# EAGLE schematic SBC_65C02_IRQ_BigBoard_v9-1-3 (EAGLE 9.6.2)

## Sheet 1 of 7: Power
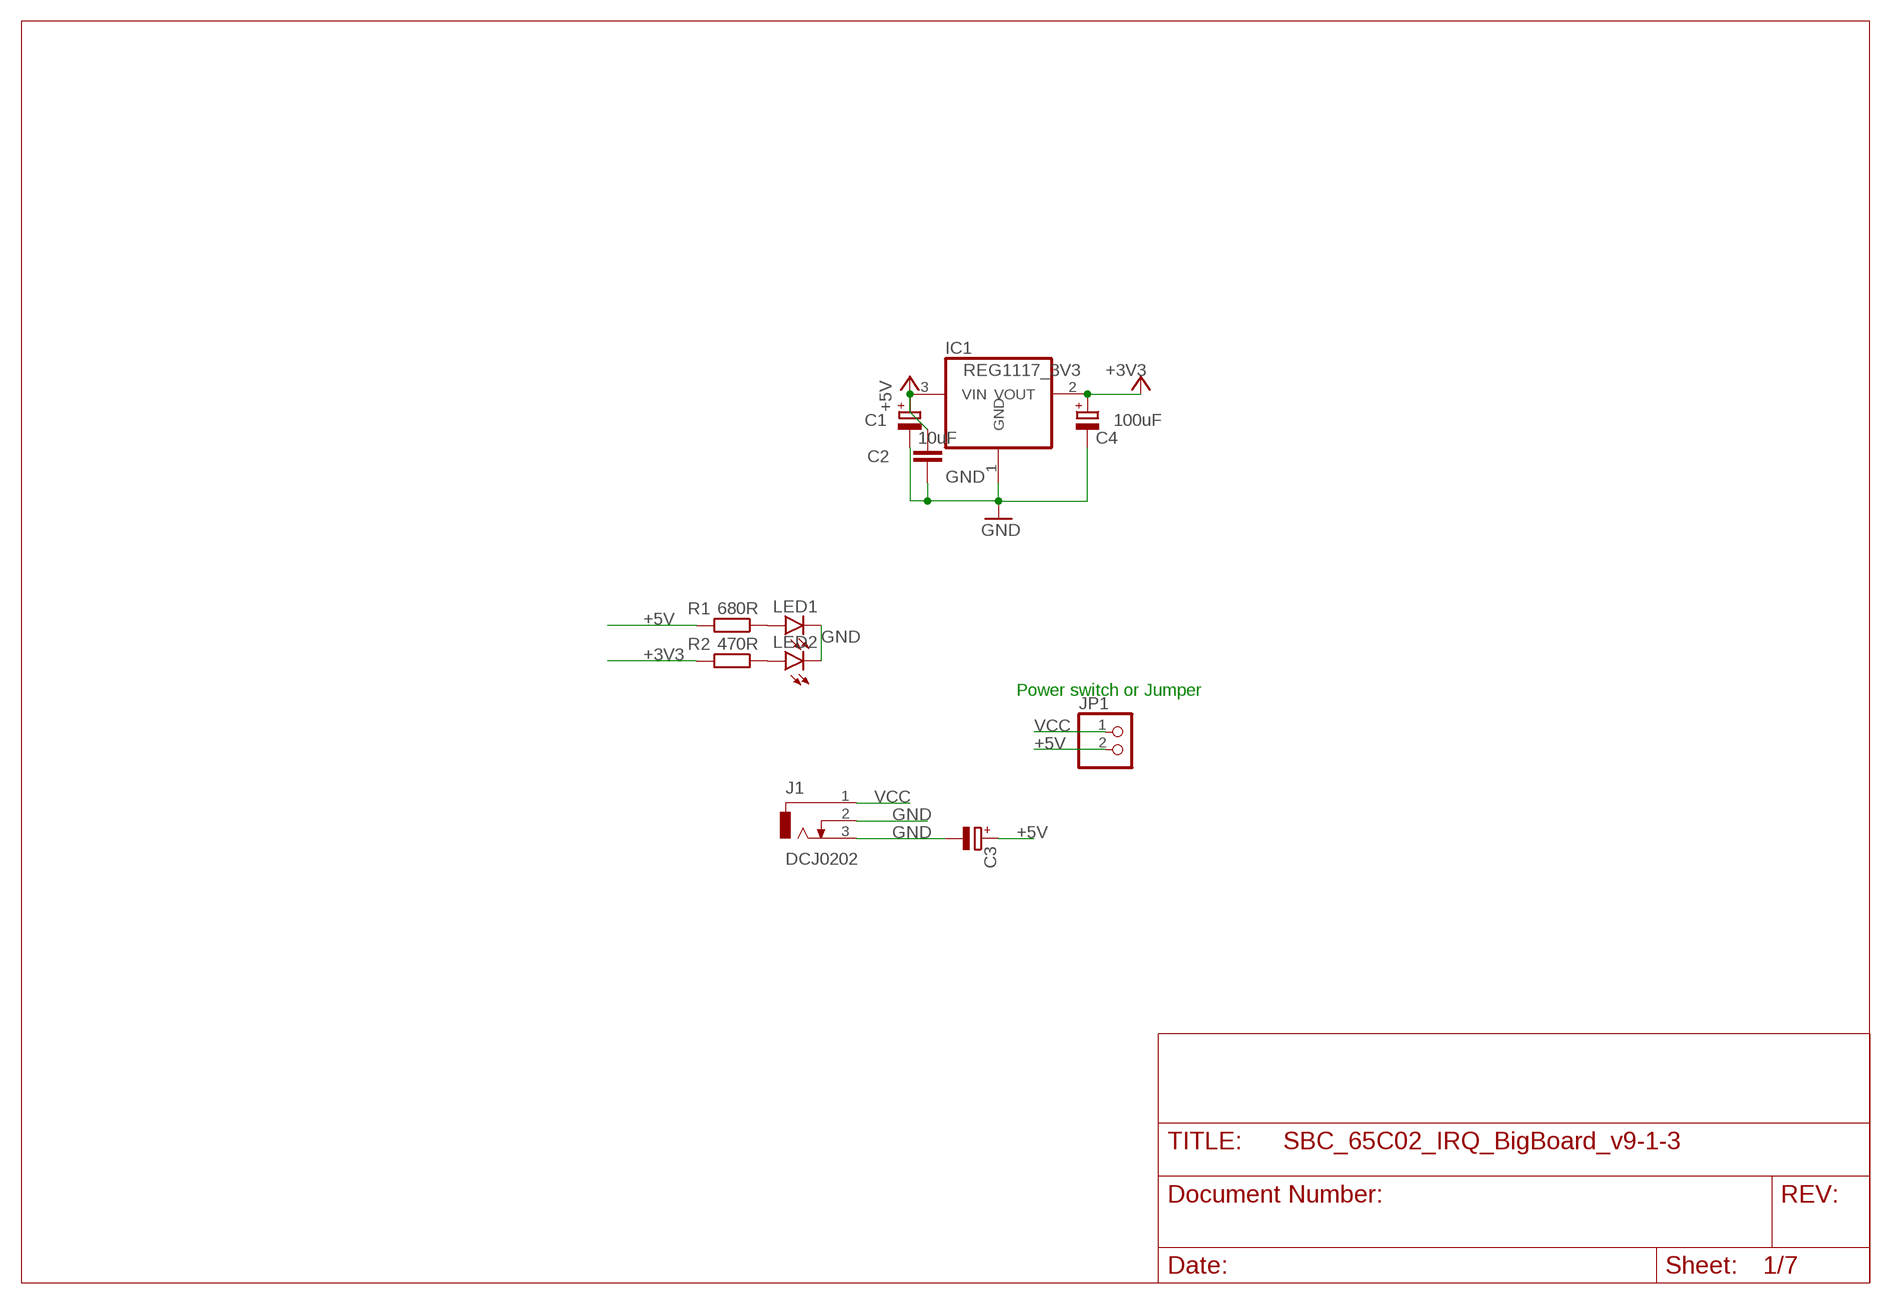
[diagram p0: schematic, sheet 1]

### Parts
C1  10uF  CPOL-EUE2.5-5  [E2,5-5]
C2  C-EU050-035X075  [C050-035X075]
C3  CPOL-EUE2.5-5  [E2,5-5]
C4  100uF  CPOL-EUE2.5-5  [E2,5-5]
IC1  REG1117_3V3  REG1117  [SOT223]
J1  DCJ0202  [DCJ0202]
JP1  PINHD-1X2  [1X02]
LED1  LED5MM  [LED5MM]
LED2  LED5MM  [LED5MM]
R1  680R  R-EU_0207/10  [0207/10]
R2  470R  R-EU_0207/10  [0207/10]

### Nets
+3V3: C4.+ IC1.2(VOUT) R2.2
+5V [power]: C1.+ C2.1 C3.+ IC1.3(VIN) JP1.2 R1.2 ; also sheet 2,3,4,5,6,7
GND: C1.- C2.2 C3.- C4.- IC1.1(GND) J1.2 J1.3 LED1.K(C) LED2.K(C) ; also sheet 2,3,4,5,6,7
N$28: LED1.A R1.1
N$29: LED2.A R2.1
VCC: J1.1 JP1.1

### Notes on the sheet
- Power switch or Jumper

## Sheet 2 of 7: Clock
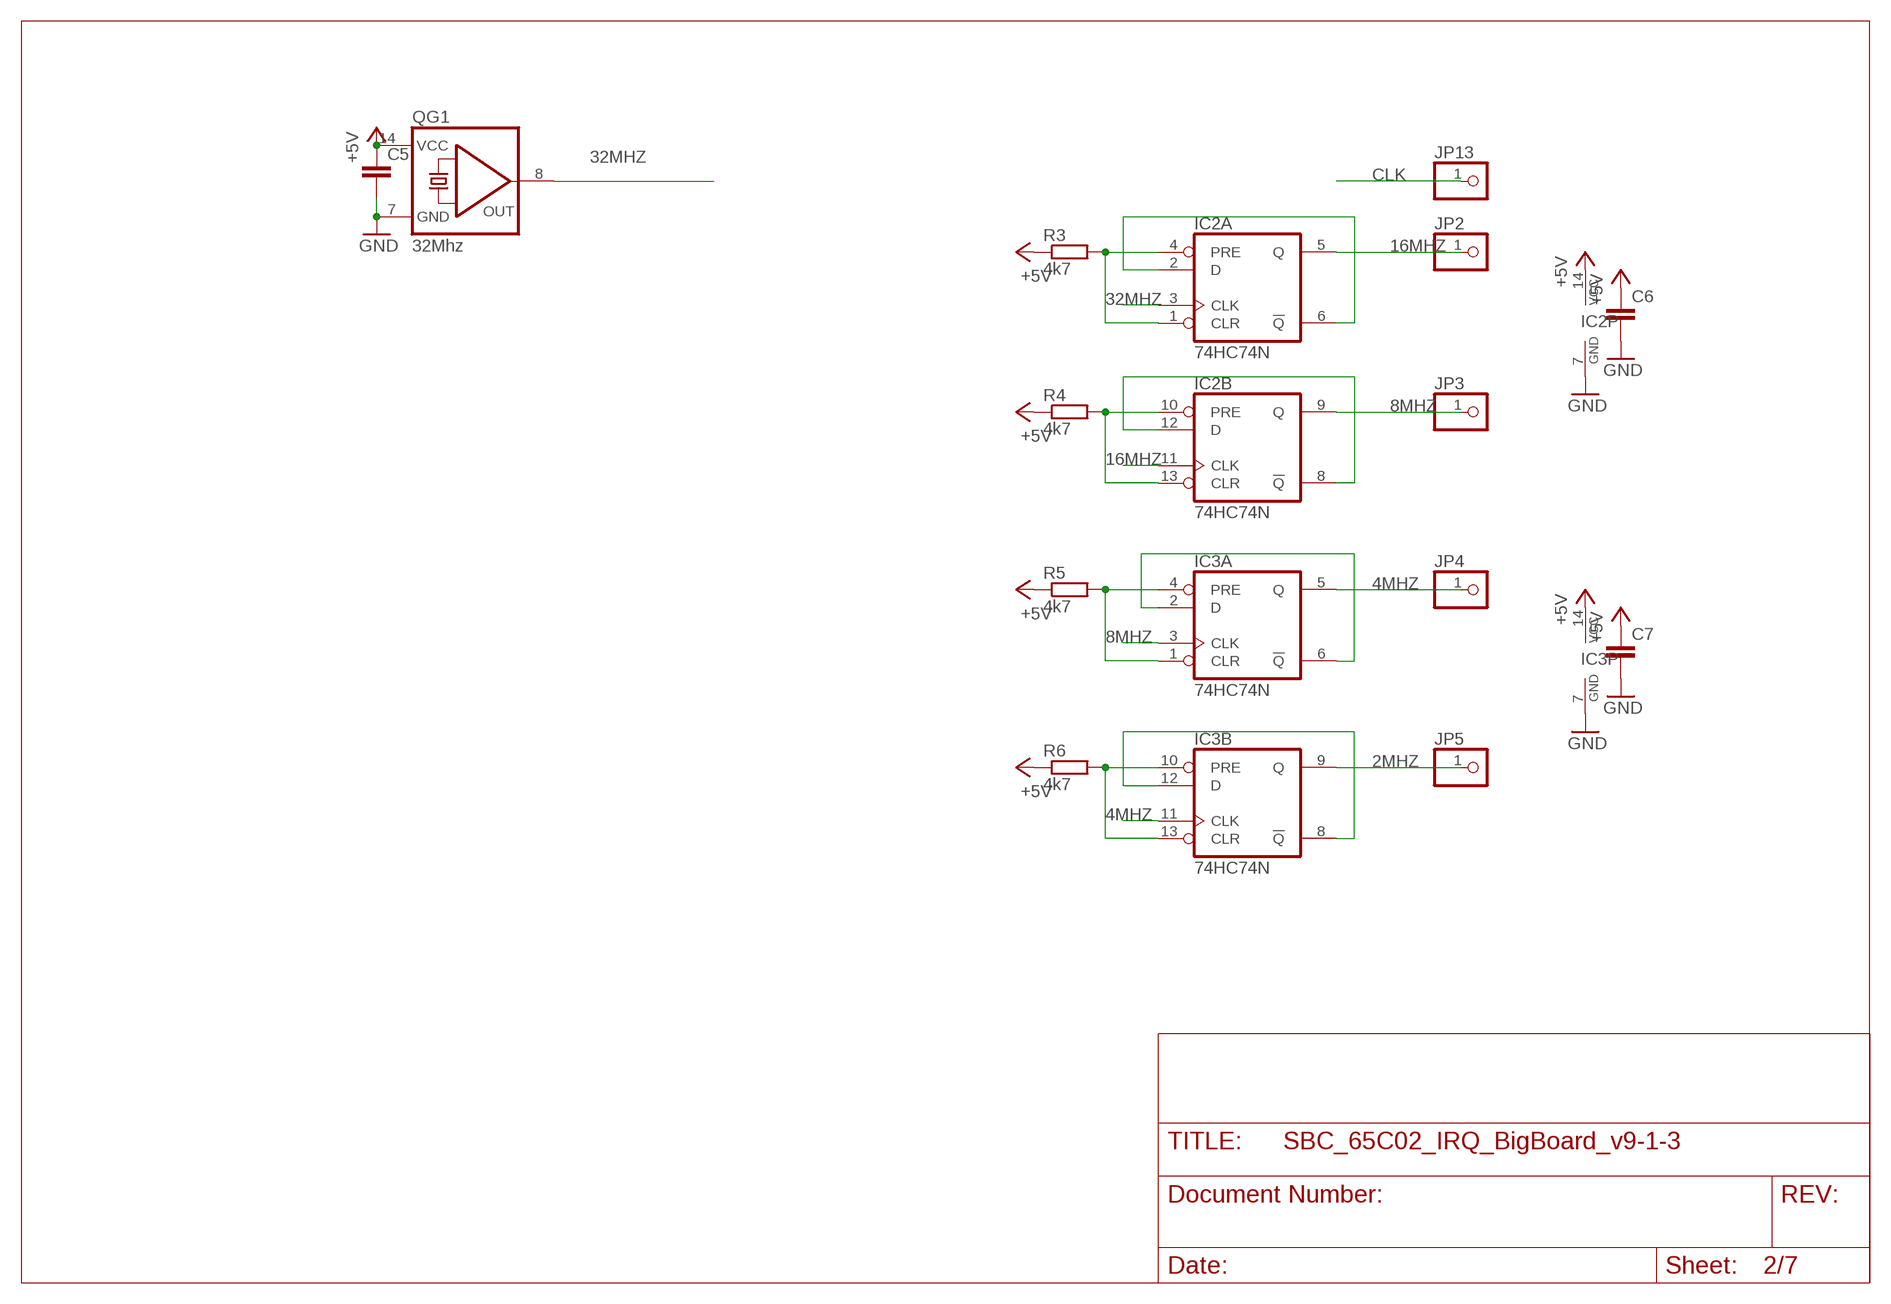
[diagram p1: schematic, sheet 2]

### Parts
C5  C-EU050-025X075  [C050-025X075]
C6  C-EU050-025X075  [C050-025X075]
C7  C-EU050-025X075  [C050-025X075]
IC2  74HC74N  [DIL14]
IC3  74HC74N  [DIL14]
JP2  PINHD-1X1  [1X01]
JP3  PINHD-1X1  [1X01]
JP4  PINHD-1X1  [1X01]
JP5  PINHD-1X1  [1X01]
JP13  PINHD-1X1  [1X01]
QG1  32Mhz  QG5860  [DIL14S]
R3  4k7  R-EU_0204/7  [0204/7]
R4  4k7  R-EU_0204/7  [0204/7]
R5  4k7  R-EU_0204/7  [0204/7]
R6  4k7  R-EU_0204/7  [0204/7]

### Nets
2MHZ: IC3.9(B:Q) JP5.1
4MHZ: IC3.5(A:Q) IC3.11(B:CLK) JP4.1
8MHZ: IC2.9(B:Q) IC3.3(A:CLK) JP3.1 ; also sheet 7
16MHZ: IC2.5(A:Q) IC2.11(B:CLK) JP2.1
32MHZ: IC2.3(A:CLK) QG1.8(OUT) ; also sheet 3
+5V [power]: C5.1 C6.1 C7.1 IC2.14(P:VCC) IC3.14(P:VCC) QG1.14(VCC) R3.1 R4.1 R5.1 R6.1 ; also sheet 1,3,4,5,6,7
CLK: JP13.1 ; also sheet 3
GND: C5.2 C6.2 C7.2 IC2.7(P:GND) IC3.7(P:GND) QG1.7(GND) ; also sheet 1,3,4,5,6,7
N$11: IC2.2(A:D) IC2.6(A:!Q)
N$14: IC2.8(B:!Q) IC2.12(B:D)
N$17: IC2.1(A:CLR) IC2.4(A:PRE) R3.2
N$18: IC2.10(B:PRE) IC2.13(B:CLR) R4.2
N$25: IC3.2(A:D) IC3.6(A:!Q)
N$26: IC3.1(A:CLR) IC3.4(A:PRE) R5.2
N$27: IC3.8(B:!Q) IC3.12(B:D)
N$30: IC3.10(B:PRE) IC3.13(B:CLR) R6.2

## Sheet 3 of 7: Main Bus CPU Memory
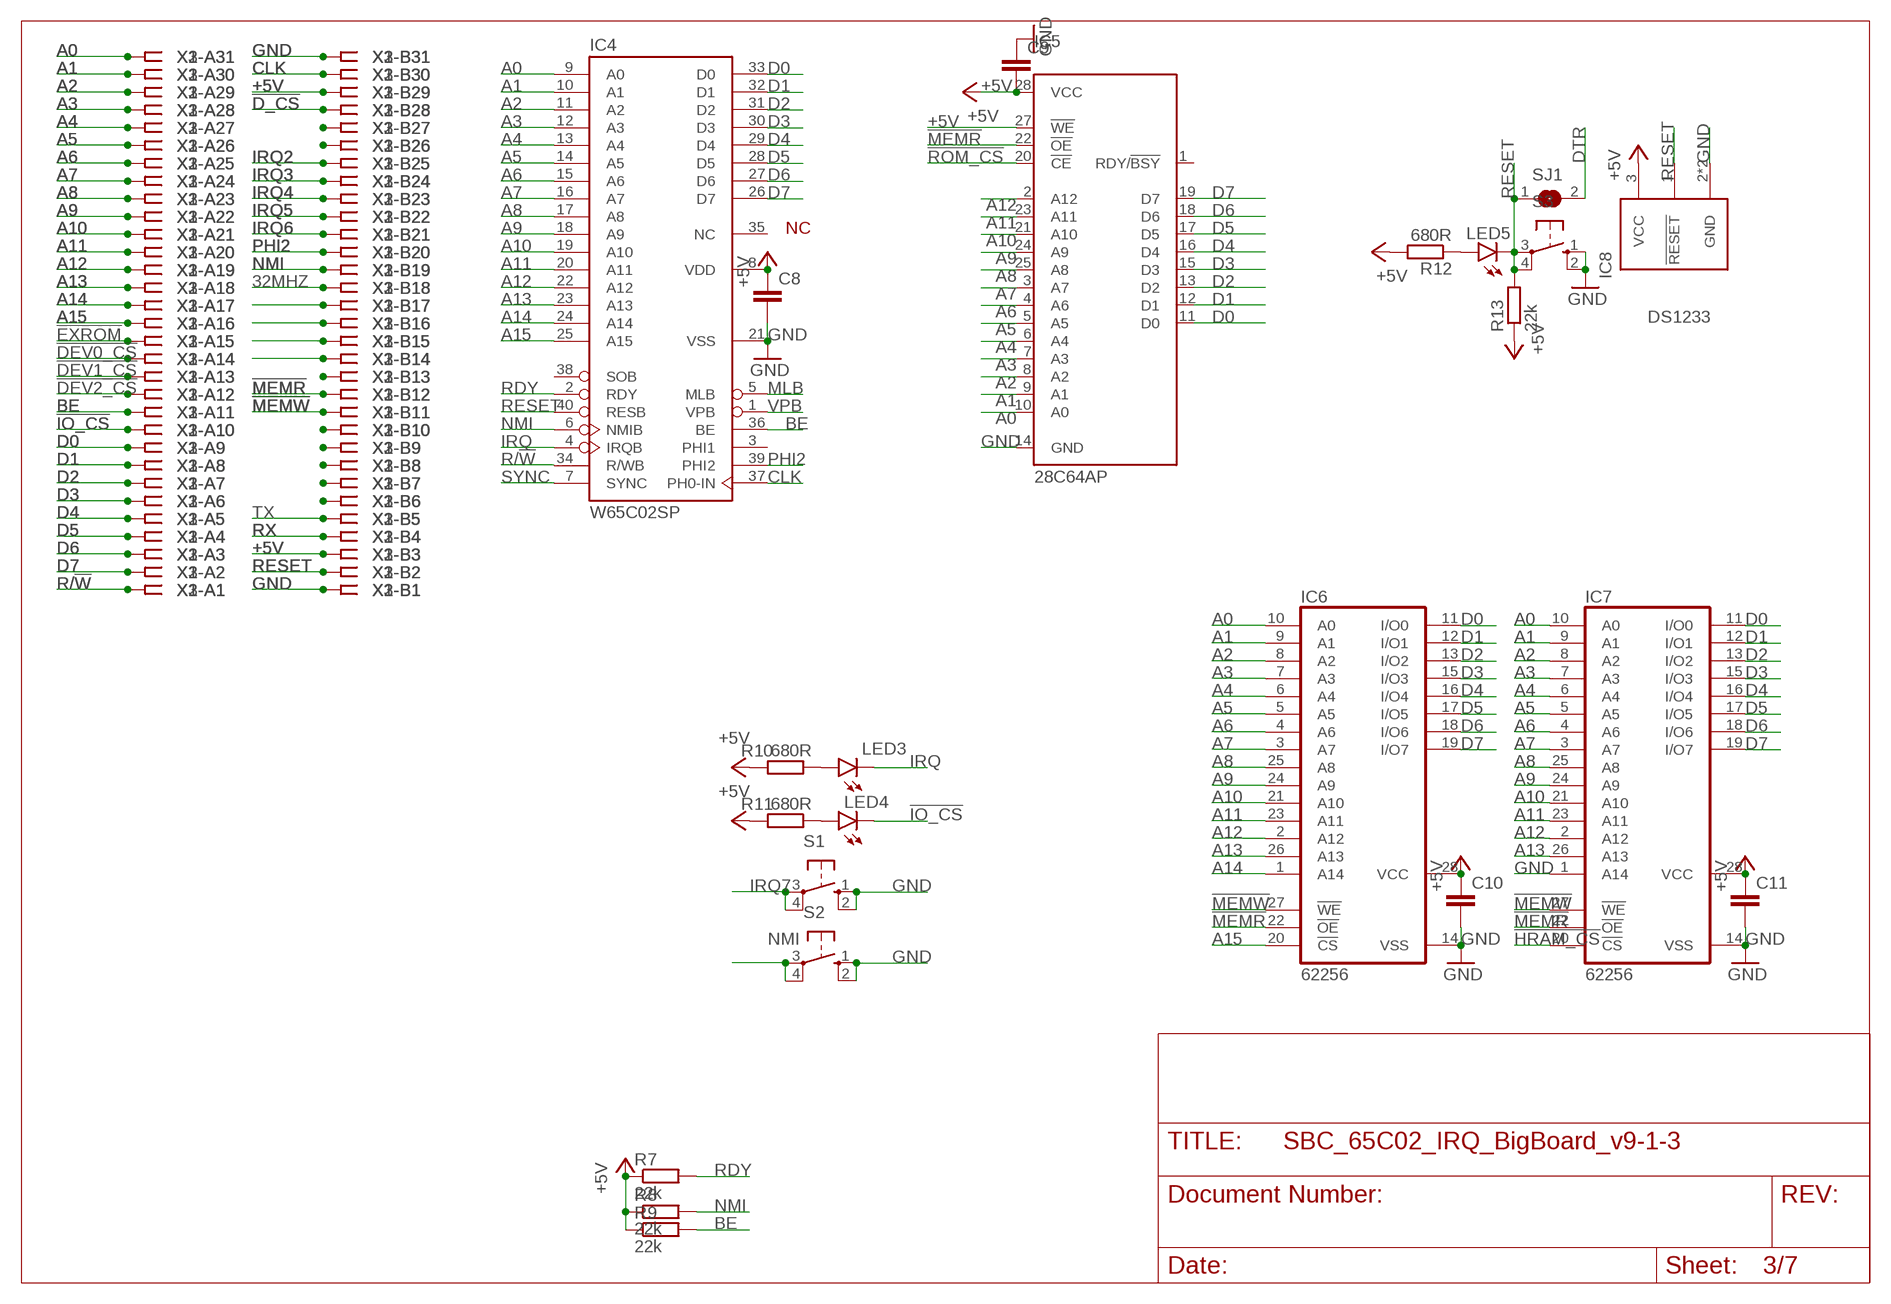
[diagram p2: schematic, sheet 3]

### Parts
C8  C-EU050-025X075  [C050-025X075]
C9  C-EU050-025X075  [C050-025X075]
C10  C-EU050-025X075  [C050-025X075]
C11  C-EU050-025X075  [C050-025X075]
IC4  W65C02SP  [DIL40]
IC5  28C64AP  [DIL28-6]
IC6  62256  62256P  [DIL28-6]
IC7  62256  62256P  [DIL28-6]
IC8  DS1233  DS1233SOT223  [SOT223]
LED3  LED5MM  [LED5MM]
LED4  LED5MM  [LED5MM]
LED5  LED5MM  [LED5MM]
R7  22k  R-EU_0207/10  [0207/10]
R8  22k  R-EU_0207/10  [0207/10]
R9  22k  R-EU_0207/10  [0207/10]
R10  680R  R-EU_0207/10  [0207/10]
R11  680R  R-EU_0207/10  [0207/10]
R12  680R  R-EU_0207/10  [0207/10]
R13  22k  R-EU_0207/10  [0207/10]
S1  10-XX  [B3F-10XX]
S2  10-XX  [B3F-10XX]
S3  10-XX  [B3F-10XX]
SJ1  SJ  [SJ]
X1  ISA-SLOT  [ISA-8]
X2  ISA-SLOT  [ISA-8]
X3  ISA-SLOT  [ISA-8]

### Nets
32MHZ: X1.B18 X2.B18 X3.B18 ; also sheet 2
!D_CS: X1.B28 X2.B28 X3.B28 ; also sheet 4
!DEV0_CS: X1.A14 X2.A14 X3.A14 ; also sheet 4
!DEV1_CS: X1.A13 X2.A13 X3.A13 ; also sheet 4
!DEV2_CS: X1.A12 X2.A12 X3.A12 ; also sheet 4
!EXROM: X1.A15 X2.A15 X3.A15 ; also sheet 4
!HRAM_CS: IC7.20(!CS) ; also sheet 4
!IO_CS: LED4.K(C) X1.A10 X2.A10 X3.A10 ; also sheet 4
!MEMR: IC5.22(!OE) IC6.22(!OE) IC7.22(!OE) X1.B12 X2.B12 X3.B12 ; also sheet 4
!MEMW: IC6.27(!WE) IC7.27(!WE) X1.B11 X2.B11 X3.B11 ; also sheet 4
!ROM_CS: IC5.20(!CE) ; also sheet 4
+5V [power]: C8.1 C9.2 C10.1 C11.1 IC4.8(VDD) IC5.27(!WE) IC5.28(VCC) IC6.28(VCC) IC7.28(VCC) IC8.3(VCC) R7.1 R8.1 R9.1 R10.2 R11.2 R12.2 R13.1 X1.B3 X1.B29 X2.B3 X2.B29 X3.B3 X3.B29 ; also sheet 1,2,4,5,6,7
A0: IC4.9(A0) IC5.10(A0) IC6.10(A0) IC7.10(A0) X1.A31 X2.A31 X3.A31 ; also sheet 6,7
A1: IC4.10(A1) IC5.9(A1) IC6.9(A1) IC7.9(A1) X1.A30 X2.A30 X3.A30 ; also sheet 6,7
A2: IC4.11(A2) IC5.8(A2) IC6.8(A2) IC7.8(A2) X1.A29 X2.A29 X3.A29 ; also sheet 6
A3: IC4.12(A3) IC5.7(A3) IC6.7(A3) IC7.7(A3) X1.A28 X2.A28 X3.A28 ; also sheet 6
A4: IC4.13(A4) IC5.6(A4) IC6.6(A4) IC7.6(A4) X1.A27 X2.A27 X3.A27
A5: IC4.14(A5) IC5.5(A5) IC6.5(A5) IC7.5(A5) X1.A26 X2.A26 X3.A26
A6: IC4.15(A6) IC5.4(A6) IC6.4(A6) IC7.4(A6) X1.A25 X2.A25 X3.A25
A7: IC4.16(A7) IC5.3(A7) IC6.3(A7) IC7.3(A7) X1.A24 X2.A24 X3.A24 ; also sheet 4,6
A8: IC4.17(A8) IC5.25(A8) IC6.25(A8) IC7.25(A8) X1.A23 X2.A23 X3.A23 ; also sheet 4
A9: IC4.18(A9) IC5.24(A9) IC6.24(A9) IC7.24(A9) X1.A22 X2.A22 X3.A22 ; also sheet 4
A10: IC4.19(A10) IC5.21(A10) IC6.21(A10) IC7.21(A10) X1.A21 X2.A21 X3.A21 ; also sheet 4
A11: IC4.20(A11) IC5.23(A11) IC6.23(A11) IC7.23(A11) X1.A20 X2.A20 X3.A20 ; also sheet 4
A12: IC4.22(A12) IC5.2(A12) IC6.2(A12) IC7.2(A12) X1.A19 X2.A19 X3.A19 ; also sheet 4
A13: IC4.23(A13) IC6.26(A13) IC7.26(A13) X1.A18 X2.A18 X3.A18 ; also sheet 4
A14: IC4.24(A14) IC6.1(A14) X1.A17 X2.A17 X3.A17 ; also sheet 4
A15: IC4.25(A15) IC6.20(!CS) X1.A16 X2.A16 X3.A16 ; also sheet 4
BE: IC4.36(BE) R9.2 X1.A11 X2.A11 X3.A11
CLK: IC4.37(PH0-IN) X1.B30 X2.B30 X3.B30 ; also sheet 2
CS_1: X1.B27 X2.B27 X3.B27
CS_2: X1.B26 X2.B26 X3.B26
D0: IC4.33(D0) IC5.11(D0) IC6.11(I/O0) IC7.11(I/O0) X1.A9 X2.A9 X3.A9 ; also sheet 6,7
D1: IC4.32(D1) IC5.12(D1) IC6.12(I/O1) IC7.12(I/O1) X1.A8 X2.A8 X3.A8 ; also sheet 6,7
D2: IC4.31(D2) IC5.13(D2) IC6.13(I/O2) IC7.13(I/O2) X1.A7 X2.A7 X3.A7 ; also sheet 6,7
D3: IC4.30(D3) IC5.15(D3) IC6.15(I/O3) IC7.15(I/O3) X1.A6 X2.A6 X3.A6 ; also sheet 6,7
D4: IC4.29(D4) IC5.16(D4) IC6.16(I/O4) IC7.16(I/O4) X1.A5 X2.A5 X3.A5 ; also sheet 6,7
D5: IC4.28(D5) IC5.17(D5) IC6.17(I/O5) IC7.17(I/O5) X1.A4 X2.A4 X3.A4 ; also sheet 6,7
D6: IC4.27(D6) IC5.18(D6) IC6.18(I/O6) IC7.18(I/O6) X1.A3 X2.A3 X3.A3 ; also sheet 6,7
D7: IC4.26(D7) IC5.19(D7) IC6.19(I/O7) IC7.19(I/O7) X1.A2 X2.A2 X3.A2 ; also sheet 6,7
DTR: SJ1.2 ; also sheet 7
GND: C8.2 C9.1 C10.2 C11.2 IC4.21(VSS) IC5.14(GND) IC6.14(VSS) IC7.1(A14) IC7.14(VSS) IC8.2(GND) IC8.4(GND) S1.1(S) S1.2(S1) S2.1(S) S2.2(S1) S3.1(S) S3.2(S1) X1.B1 X1.B31 X2.B1 X2.B31 X3.B1 X3.B31 ; also sheet 1,2,4,5,6,7
IRQ: IC4.4(IRQB) LED3.K(C) ; also sheet 6
IRQ2: X1.B25 X2.B25 X3.B25 ; also sheet 6
IRQ3: X1.B24 X2.B24 X3.B24 ; also sheet 6
IRQ4: X1.B23 X2.B23 X3.B23 ; also sheet 6
IRQ5: X1.B22 X2.B22 X3.B22 ; also sheet 6
IRQ6: X1.B21 X2.B21 X3.B21 ; also sheet 6
IRQ7: S1.3(P) S1.4(P1) ; also sheet 6
MLB: IC4.5(MLB)
N$2: LED3.A R10.1
N$6: LED5.A R12.1
N$7: X1.B6 X2.B6 X3.B6
N$8: X1.B7 X2.B7 X3.B7
N$9: X1.B8 X2.B8 X3.B8
N$13: LED4.A R11.1
N$19: X1.B9 X2.B9 X3.B9
N$20: X1.B10 X2.B10 X3.B10
N$21: X1.B13 X2.B13 X3.B13
N$22: X1.B14 X2.B14 X3.B14
NMI: IC4.6(NMIB) R8.2 S2.3(P) S2.4(P1) X1.B19 X2.B19 X3.B19 ; also sheet 6
PHI2: IC4.39(PHI2) X1.B20 X2.B20 X3.B20 ; also sheet 4,6,7
R/!W: IC4.34(R/WB) X1.A1 X2.A1 X3.A1 ; also sheet 4,6,7
RDY: IC4.2(RDY) R7.2
RESET: IC4.40(RESB) IC8.1(!RESET) LED5.K(C) R13.2 S3.3(P) S3.4(P1) SJ1.1 X1.B2 X2.B2 X3.B2 ; also sheet 6,7
RX: X1.B4 X2.B4 X3.B4 ; also sheet 7
SPI_MOSI: X1.B17 X2.B17 X3.B17
SPI_NSEL2: X1.B15 X2.B15 X3.B15
SPI_SCLK: X1.B16 X2.B16 X3.B16
SYNC: IC4.7(SYNC)
TX: X1.B5 X2.B5 X3.B5 ; also sheet 7
VPB: IC4.1(VPB)
Unconnected: IC4.3(PHI1) IC4.35(NC) IC4.38(SOB) IC5.1(RDY/!BSY)

## Sheet 4 of 7: Decoder
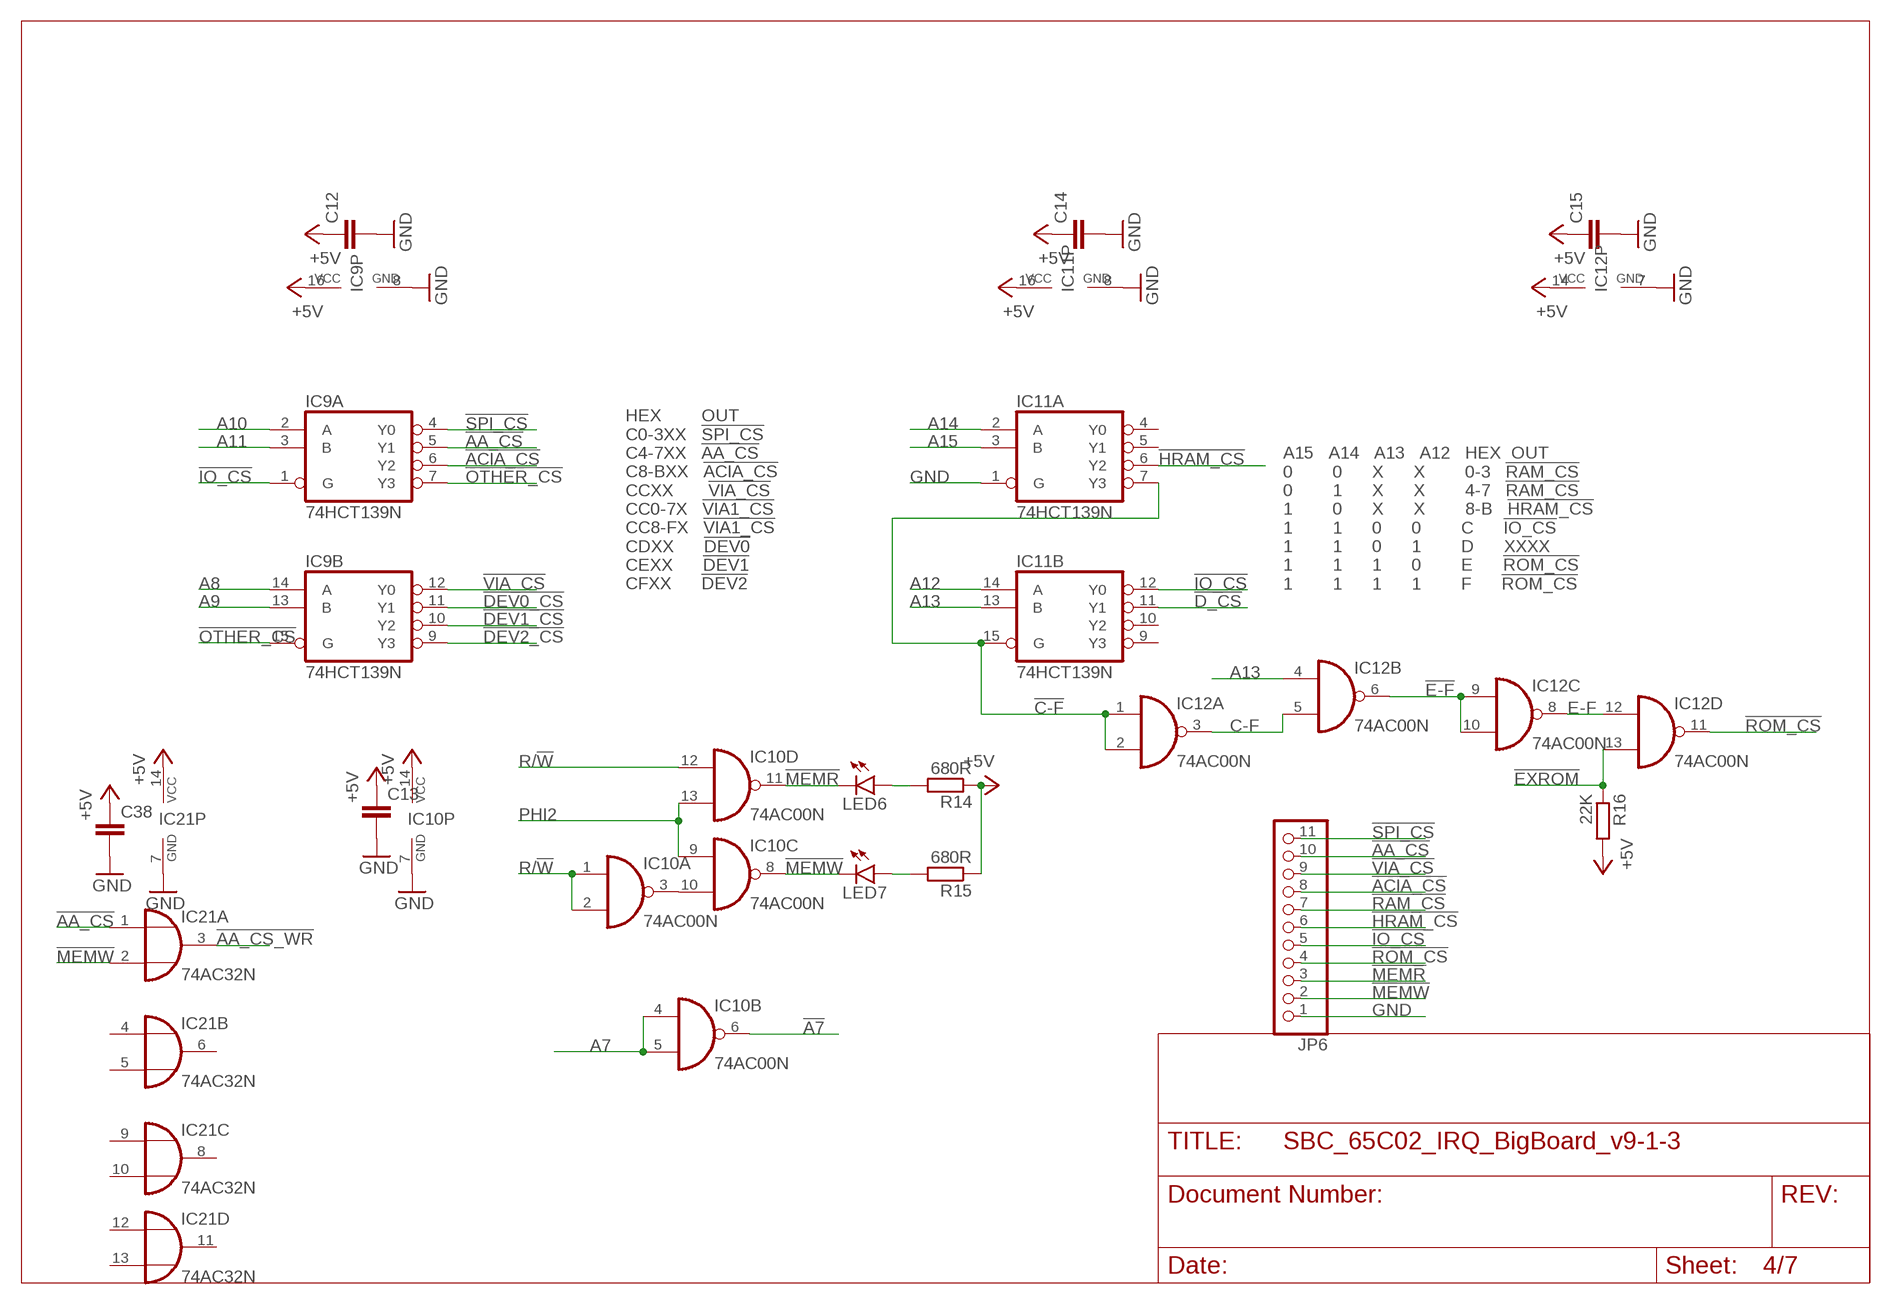
[diagram p3: schematic, sheet 4]

### Parts
C12  C-EU050-025X075  [C050-025X075]
C13  C-EU050-025X075  [C050-025X075]
C14  C-EU050-025X075  [C050-025X075]
C15  C-EU050-025X075  [C050-025X075]
C38  C-EU050-025X075  [C050-025X075]
IC9  74HCT139N  [DIL16]
IC10  74AC00N  [DIL14]
IC11  74HCT139N  [DIL16]
IC12  74AC00N  [DIL14]
IC21  74AC32N  [DIL14]
JP6  PINHD-1X11  [1X11]
LED6  LED5MM  [LED5MM]
LED7  LED5MM  [LED5MM]
R14  680R  R-EU_0207/10  [0207/10]
R15  680R  R-EU_0207/10  [0207/10]
R16  22K  R-EU_0207/10  [0207/10]

### Nets
!A7: IC10.6(B:O) ; also sheet 6
!AA_CS: IC9.5(A:Y1) IC21.1(A:I0) JP6.10
!AA_CS_WR: IC21.3(A:O) ; also sheet 7
!ACIA_CS: IC9.6(A:Y2) JP6.8 ; also sheet 7
!C-F: IC11.7(A:Y3) IC11.15(B:G) IC12.1(A:I0) IC12.2(A:I1)
!D_CS: IC11.11(B:Y1) ; also sheet 3
!DEV0_CS: IC9.11(B:Y1) ; also sheet 3
!DEV1_CS: IC9.10(B:Y2) ; also sheet 3
!DEV2_CS: IC9.9(B:Y3) ; also sheet 3
!E-F: IC12.6(B:O) IC12.9(C:I0) IC12.10(C:I1)
!EXROM: IC12.13(D:I1) R16.1 ; also sheet 3
!HRAM_CS: IC11.6(A:Y2) JP6.6 ; also sheet 3
!IO_CS: IC9.1(A:G) IC11.12(B:Y0) JP6.5 ; also sheet 3
!MEMR: IC10.11(D:O) JP6.3 LED6.K(C) ; also sheet 3
!MEMW: IC10.8(C:O) IC21.2(A:I1) JP6.2 LED7.K(C) ; also sheet 3
!OTHER_CS: IC9.7(A:Y3) IC9.15(B:G)
!RAM_CS: JP6.7
!ROM_CS: IC12.11(D:O) JP6.4 ; also sheet 3
!SPI_CS: IC9.4(A:Y0) JP6.11
!VIA_CS: IC9.12(B:Y0) JP6.9 ; also sheet 6
+5V [power]: C12.1 C13.1 C14.1 C15.1 C38.1 IC9.16(P:VCC) IC10.14(P:VCC) IC11.16(P:VCC) IC12.14(P:VCC) IC21.14(P:VCC) R14.1 R15.1 R16.2 ; also sheet 1,2,3,5,6,7
A7: IC10.4(B:I0) IC10.5(B:I1) ; also sheet 3,6
A8: IC9.14(B:A) ; also sheet 3
A9: IC9.13(B:B) ; also sheet 3
A10: IC9.2(A:A) ; also sheet 3
A11: IC9.3(A:B) ; also sheet 3
A12: IC11.14(B:A) ; also sheet 3
A13: IC11.13(B:B) IC12.4(B:I0) ; also sheet 3
A14: IC11.2(A:A) ; also sheet 3
A15: IC11.3(A:B) ; also sheet 3
C-F: IC12.3(A:O) IC12.5(B:I1)
E-F: IC12.8(C:O) IC12.12(D:I0)
GND: C12.2 C13.2 C14.2 C15.2 C38.2 IC9.8(P:GND) IC10.7(P:GND) IC11.1(A:G) IC11.8(P:GND) IC12.7(P:GND) IC21.7(P:GND) JP6.1 ; also sheet 1,2,3,5,6,7
N$23: LED6.A R14.2
N$24: LED7.A R15.2
N$155: IC10.3(A:O) IC10.10(C:I1)
PHI2: IC10.9(C:I0) IC10.13(D:I1) ; also sheet 3,6,7
R/!W: IC10.1(A:I0) IC10.2(A:I1) IC10.12(D:I0) ; also sheet 3,6,7
Unconnected: IC11.4(A:Y0) IC11.5(A:Y1) IC11.9(B:Y3) IC11.10(B:Y2) IC21.4(B:I0) IC21.5(B:I1) IC21.6(B:O) IC21.8(C:O) IC21.9(C:I0) IC21.10(C:I1) IC21.11(D:O) IC21.12(D:I0) IC21.13(D:I1)

### Notes on the sheet
- HEX        OUT
  C0-3XX   !SPI_CS
  C4-7XX   !AA_CS
  C8-BXX   !ACIA_CS
  CCXX       !VIA_CS
  CC0-7X   !VIA1_CS
  CC8-FX   !VIA1_CS
  CDXX      !DEV0
  CEXX      !DEV1
  CFXX      !DEV2
- A15   A14   A13   A12   HEX  OUT
  0        0      X      X        0-3   !RAM_CS
  0        1      X      X        4-7   !RAM_CS
  1        0      X      X        8-B   !HRAM_CS
  1        1      0      0        C      !IO_CS
  1        1      0      1        D      XXXX
  1        1      1      0        E      !ROM_CS
  1        1      1      1        F      !ROM_CS

## Sheet 5 of 7: PS2&SPI
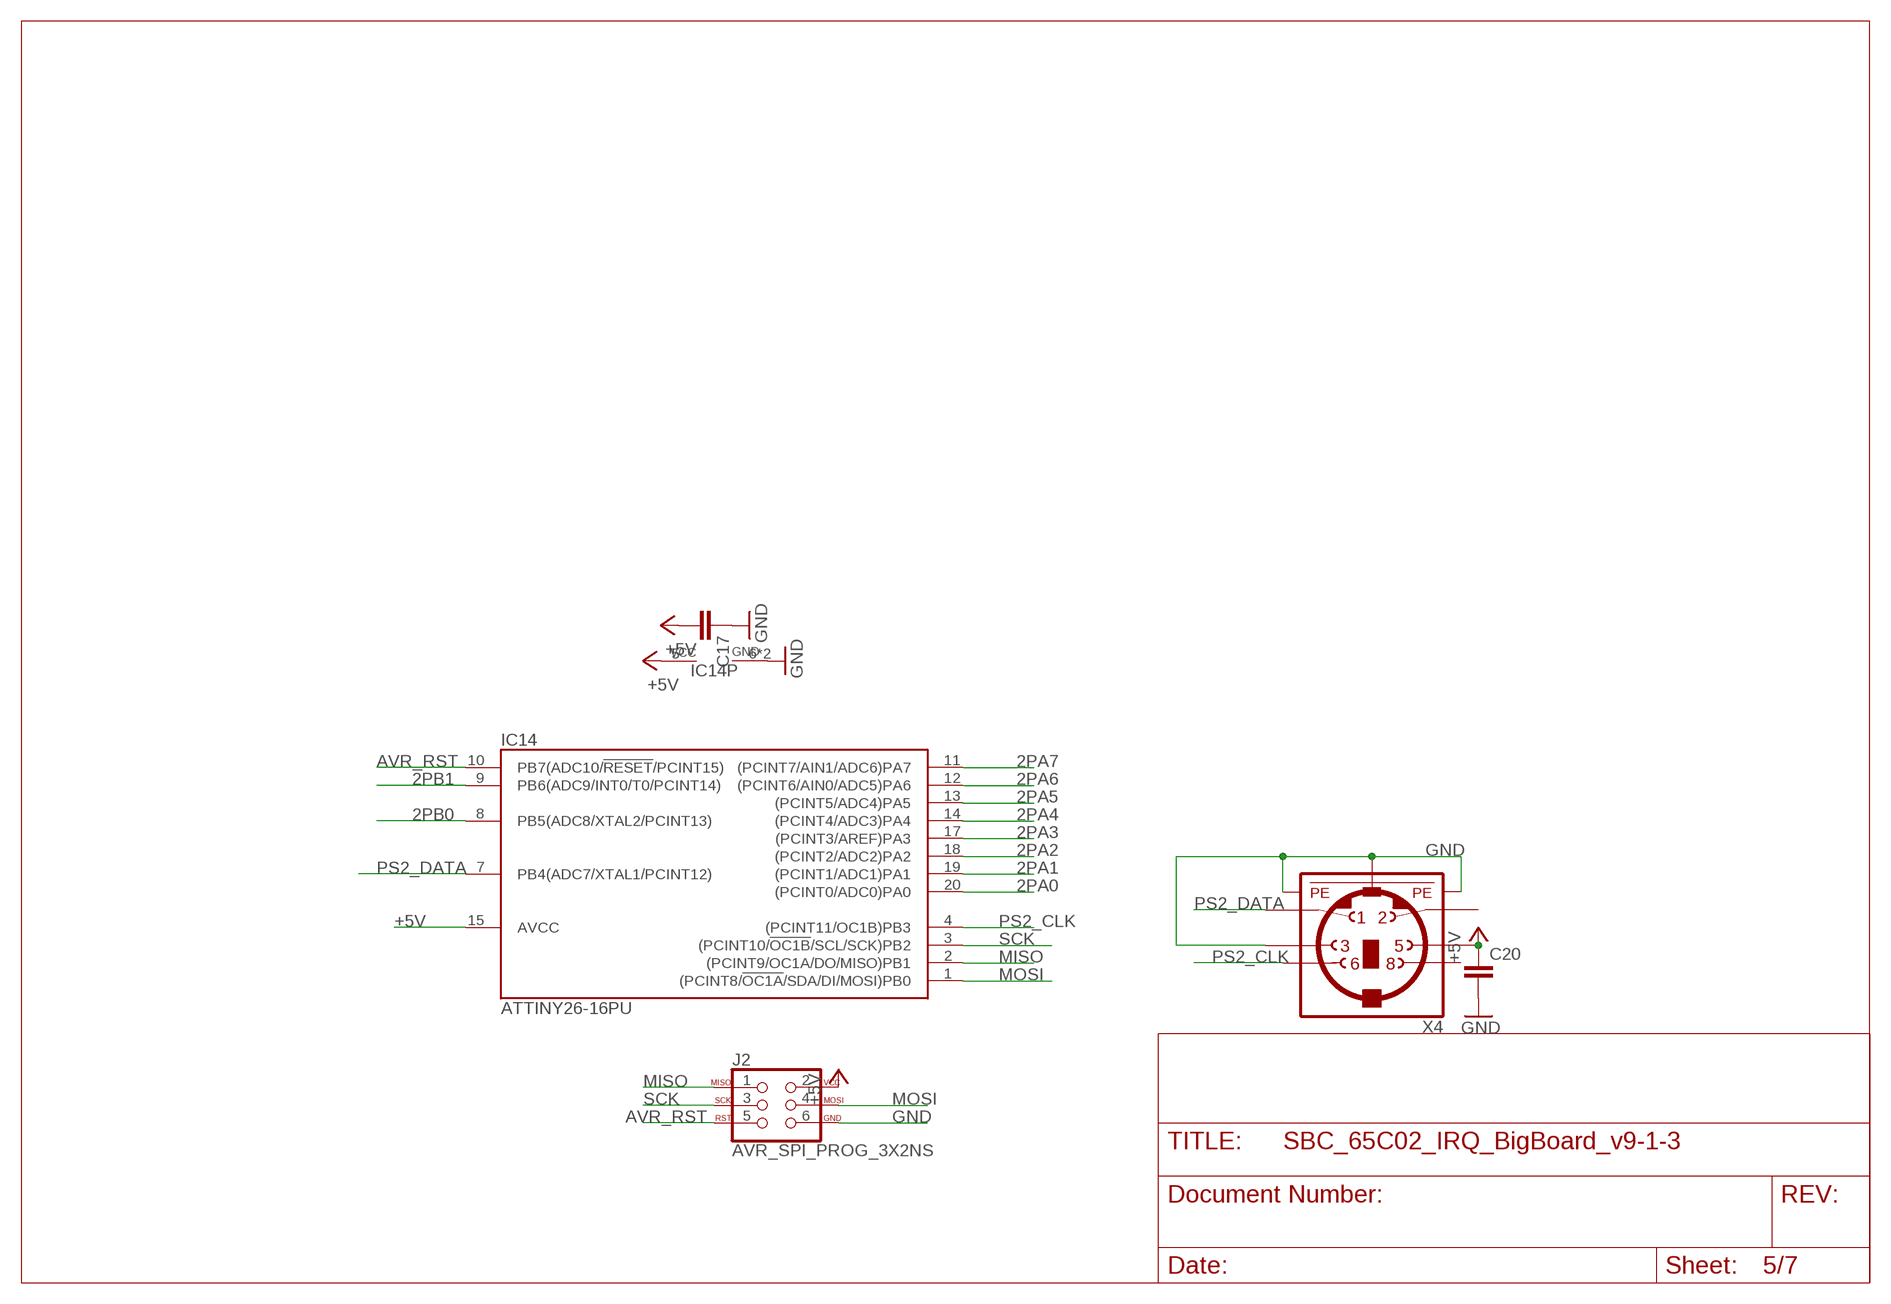
[diagram p4: schematic, sheet 5]

### Parts
C17  C-EU050-025X075  [C050-025X075]
C20  C-EU050-025X075  [C050-025X075]
IC14  ATTINY26-16PU  [DIL20]
J2  AVR_SPI_PROG_3X2NS  [2X3-NS]
X4  MINI_DIN_6  [M_DIN6]

### Nets
2PA0: IC14.20((PCINT0/ADC0)PA0) ; also sheet 6
2PA1: IC14.19((PCINT1/ADC1)PA1) ; also sheet 6
2PA2: IC14.18((PCINT2/ADC2)PA2) ; also sheet 6
2PA3: IC14.17((PCINT3/AREF)PA3) ; also sheet 6
2PA4: IC14.14((PCINT4/ADC3)PA4) ; also sheet 6
2PA5: IC14.13((PCINT5/ADC4)PA5) ; also sheet 6
2PA6: IC14.12((PCINT6/AIN0/ADC5)PA6) ; also sheet 6
2PA7: IC14.11((PCINT7/AIN1/ADC6)PA7) ; also sheet 6
2PB0: IC14.8(PB5(ADC8/XTAL2/PCINT13)) ; also sheet 6
2PB1: IC14.9(PB6(ADC9/INT0/T0/PCINT14)) ; also sheet 6
+5V [power]: C17.2 C20.1 IC14.5(VCC) IC14.15(AVCC) J2.2 X4.5 ; also sheet 1,2,3,4,6,7
AVR_RST: IC14.10(PB7(ADC10/!RESET!/PCINT15)) J2.5
GND: C17.1 C20.2 IC14.6(GND) IC14.16(GND) J2.6 X4.3 X4.SH1(PE1) X4.SH2(PE2) X4.SH3(PE3) ; also sheet 1,2,3,4,6,7
MISO: IC14.2((PCINT9/OC1A/DO/MISO)PB1) J2.1
MOSI: IC14.1((PCINT8/!OC1A!/SDA/DI/MOSI)PB0) J2.4
PS2_CLK: IC14.4((PCINT11/OC1B)PB3) X4.6
PS2_DATA: IC14.7(PB4(ADC7/XTAL1/PCINT12)) X4.1
SCK: IC14.3((PCINT10/!OC1B!/SCL/SCK)PB2) J2.3
Unconnected: X4.2 X4.8

## Sheet 6 of 7: VIA&IRQ
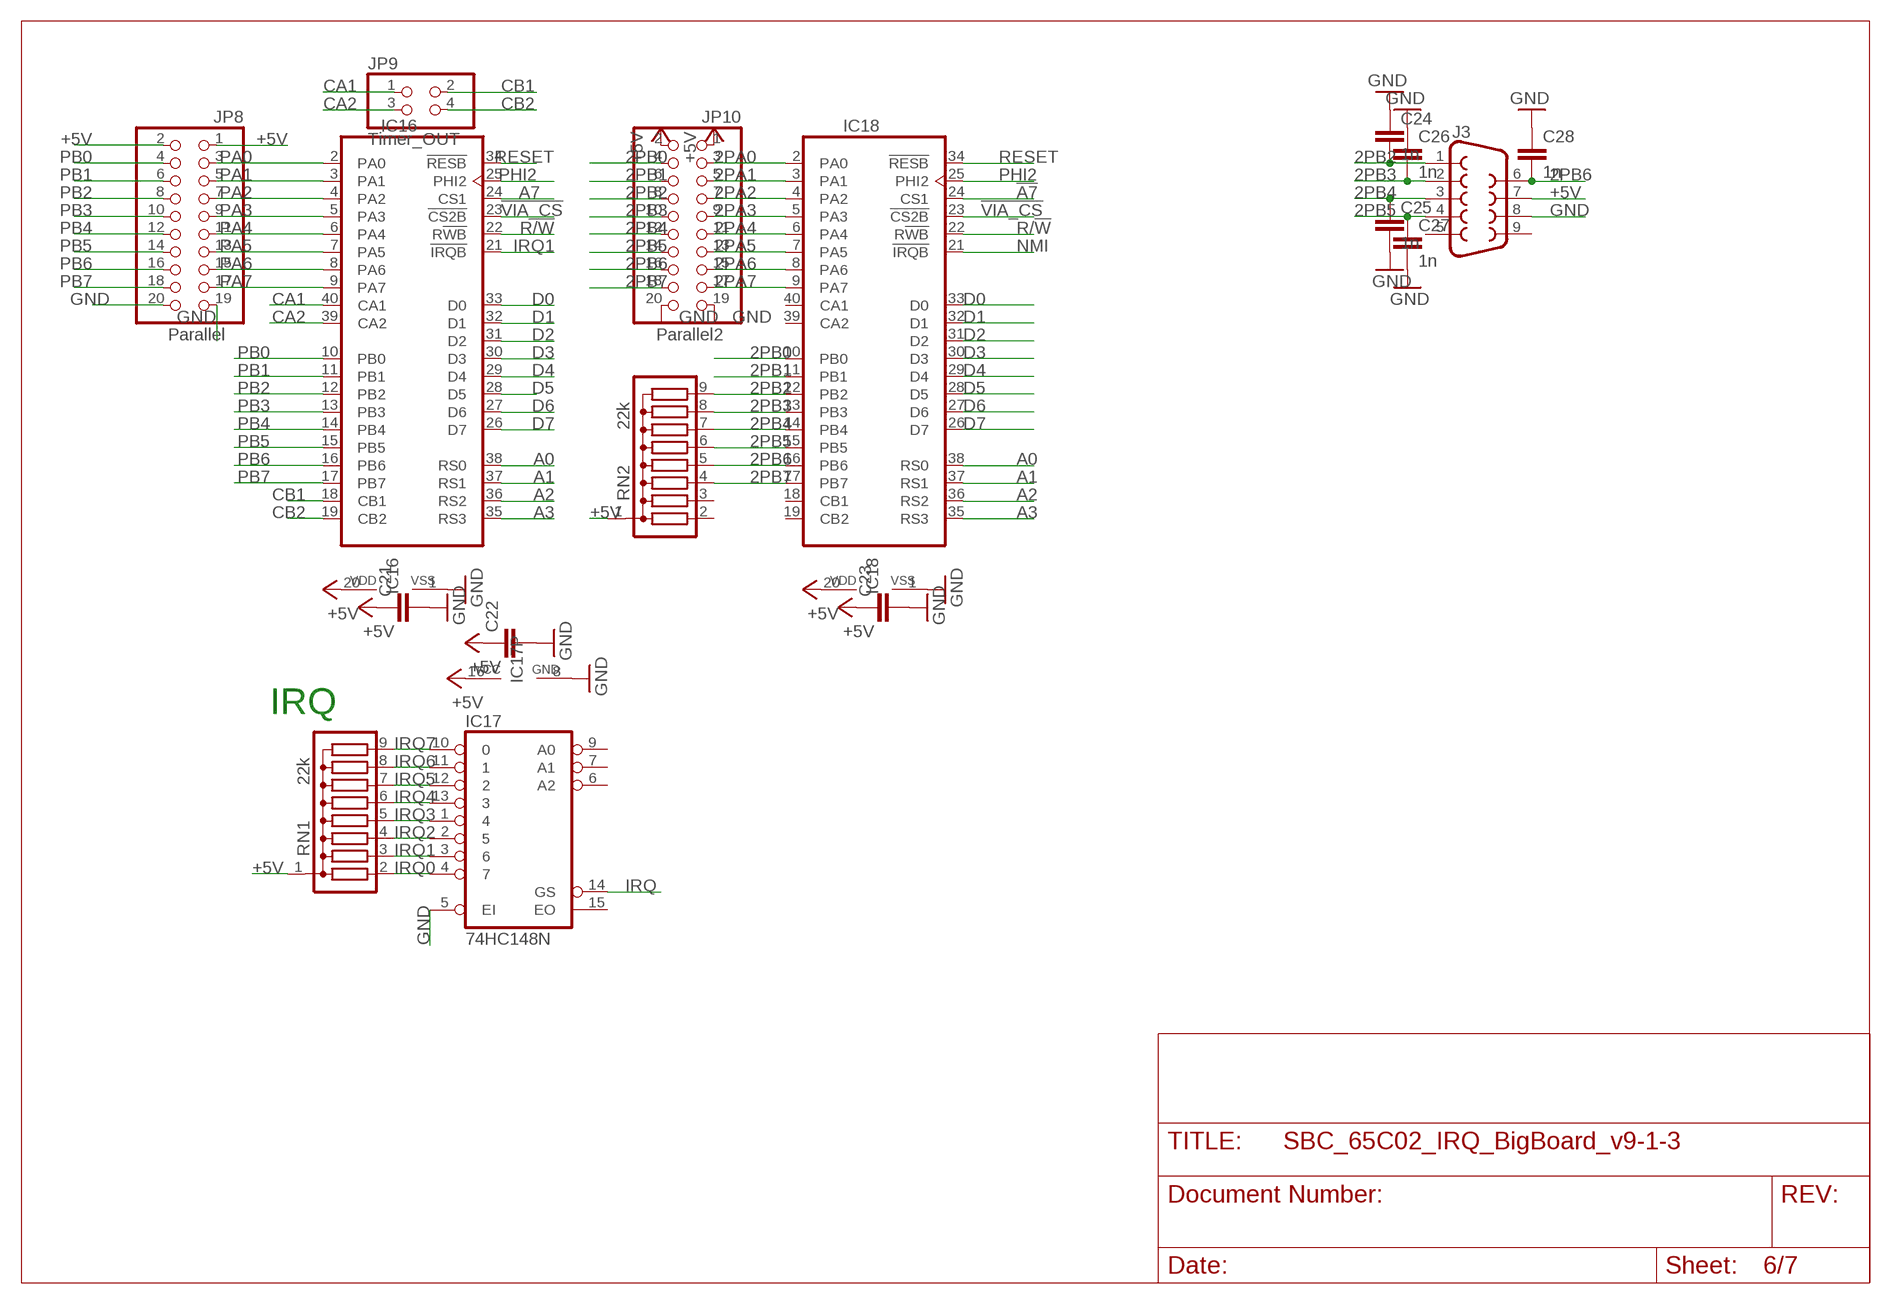
[diagram p5: schematic, sheet 6]

### Parts
C21  C-EU050-025X075  [C050-025X075]
C22  C-EU050-025X075  [C050-025X075]
C23  C-EU050-025X075  [C050-025X075]
C24  1n  C-EU050-025X075  [C050-025X075]
C25  1n  C-EU050-025X075  [C050-025X075]
C26  1n  C-EU050-025X075  [C050-025X075]
C27  1n  C-EU050-025X075  [C050-025X075]
C28  1n  C-EU050-025X075  [C050-025X075]
IC16  W65C22S6TP  [DIL40]
IC17  74HC148N  [DIL16]
IC18  W65C22S6TP  [DIL40]
J3  DB9MALE  [DB9_MALE]
JP8  Parallel  PINHD-2X10  [2X10]
JP9  Timer_OUT  PINHD-2X2  [2X02]
JP10  Parallel2  PINHD-2X10  [2X10]
RN1  22k  G08R  [SIL9]
RN2  22k  G08R  [SIL9]

### Nets
2PA0: IC18.2(VIA:PA0) JP10.3 ; also sheet 5
2PA1: IC18.3(VIA:PA1) JP10.5 ; also sheet 5
2PA2: IC18.4(VIA:PA2) JP10.7 ; also sheet 5
2PA3: IC18.5(VIA:PA3) JP10.9 ; also sheet 5
2PA4: IC18.6(VIA:PA4) JP10.11 ; also sheet 5
2PA5: IC18.7(VIA:PA5) JP10.13 ; also sheet 5
2PA6: IC18.8(VIA:PA6) JP10.15 ; also sheet 5
2PA7: IC18.9(VIA:PA7) JP10.17 ; also sheet 5
2PB0: IC18.10(VIA:PB0) JP10.4 ; also sheet 5
2PB1: IC18.11(VIA:PB1) JP10.6 ; also sheet 5
2PB2: C24.2 IC18.12(VIA:PB2) J3.1 JP10.8 RN2.9
2PB3: C26.2 IC18.13(VIA:PB3) J3.2 JP10.10 RN2.8
2PB4: C25.1 IC18.14(VIA:PB4) J3.3 JP10.12 RN2.7
2PB5: C27.1 IC18.15(VIA:PB5) J3.4 JP10.14 RN2.6
2PB6: C28.2 IC18.16(VIA:PB6) J3.6 JP10.16 RN2.5
2PB7: IC18.17(VIA:PB7) JP10.18 RN2.4
!A7: IC18.24(VIA:CS1) ; also sheet 4
!VIA_CS: IC16.23(VIA:!CS2B) IC18.23(VIA:!CS2B) ; also sheet 4
+5V [power]: C21.1 C22.1 C23.1 IC16.20(VIAP:VDD) IC17.16(VCC) IC18.20(VIAP:VDD) J3.7 JP8.1 JP8.2 JP10.1 JP10.2 RN1.1 RN2.1 ; also sheet 1,2,3,4,5,7
A0: IC16.38(VIA:RS0) IC18.38(VIA:RS0) ; also sheet 3,7
A1: IC16.37(VIA:RS1) IC18.37(VIA:RS1) ; also sheet 3,7
A2: IC16.36(VIA:RS2) IC18.36(VIA:RS2) ; also sheet 3
A3: IC16.35(VIA:RS3) IC18.35(VIA:RS3) ; also sheet 3
A7: IC16.24(VIA:CS1) ; also sheet 3,4
CA1: IC16.40(VIA:CA1) JP9.1
CA2: IC16.39(VIA:CA2) JP9.3
CB1: IC16.18(VIA:CB1) JP9.2
CB2: IC16.19(VIA:CB2) JP9.4
D0: IC16.33(VIA:D0) IC18.33(VIA:D0) ; also sheet 3,7
D1: IC16.32(VIA:D1) IC18.32(VIA:D1) ; also sheet 3,7
D2: IC16.31(VIA:D2) IC18.31(VIA:D2) ; also sheet 3,7
D3: IC16.30(VIA:D3) IC18.30(VIA:D3) ; also sheet 3,7
D4: IC16.29(VIA:D4) IC18.29(VIA:D4) ; also sheet 3,7
D5: IC16.28(VIA:D5) IC18.28(VIA:D5) ; also sheet 3,7
D6: IC16.27(VIA:D6) IC18.27(VIA:D6) ; also sheet 3,7
D7: IC16.26(VIA:D7) IC18.26(VIA:D7) ; also sheet 3,7
GND: C21.2 C22.2 C23.2 C24.1 C25.2 C26.1 C27.2 C28.1 IC16.1(VIAP:VSS) IC17.5(EI) IC17.8(GND) IC18.1(VIAP:VSS) J3.8 JP8.19 JP8.20 JP10.19 JP10.20 ; also sheet 1,2,3,4,5,7
IRQ: IC17.14(GS) ; also sheet 3
IRQ0: IC17.4 RN1.2 ; also sheet 7
IRQ1: IC16.21(VIA:!IRQB) IC17.3 RN1.3
IRQ2: IC17.2 RN1.4 ; also sheet 3
IRQ3: IC17.1 RN1.5 ; also sheet 3
IRQ4: IC17.13 RN1.6 ; also sheet 3
IRQ5: IC17.12 RN1.7 ; also sheet 3
IRQ6: IC17.11 RN1.8 ; also sheet 3
IRQ7: IC17.10 RN1.9 ; also sheet 3
NMI: IC18.21(VIA:!IRQB) ; also sheet 3
PA0: IC16.2(VIA:PA0) JP8.3
PA1: IC16.3(VIA:PA1) JP8.5
PA2: IC16.4(VIA:PA2) JP8.7
PA3: IC16.5(VIA:PA3) JP8.9
PA4: IC16.6(VIA:PA4) JP8.11
PA5: IC16.7(VIA:PA5) JP8.13
PA6: IC16.8(VIA:PA6) JP8.15
PA7: IC16.9(VIA:PA7) JP8.17
PB0: IC16.10(VIA:PB0) JP8.4
PB1: IC16.11(VIA:PB1) JP8.6
PB2: IC16.12(VIA:PB2) JP8.8
PB3: IC16.13(VIA:PB3) JP8.10
PB4: IC16.14(VIA:PB4) JP8.12
PB5: IC16.15(VIA:PB5) JP8.14
PB6: IC16.16(VIA:PB6) JP8.16
PB7: IC16.17(VIA:PB7) JP8.18
PHI2: IC16.25(VIA:PHI2) IC18.25(VIA:PHI2) ; also sheet 3,4,7
R/!W: IC16.22(VIA:R!WB) IC18.22(VIA:R!WB) ; also sheet 3,4,7
RESET: IC16.34(VIA:!RESB) IC18.34(VIA:!RESB) ; also sheet 3,7
Unconnected: IC17.6(A2) IC17.7(A1) IC17.9(A0) IC17.15(EO) IC18.18(VIA:CB1) IC18.19(VIA:CB2) IC18.39(VIA:CA2) IC18.40(VIA:CA1) J3.5 J3.9 RN2.2 RN2.3

### Notes on the sheet
- IRQ

## Sheet 7 of 7: ACIA&SAA1099
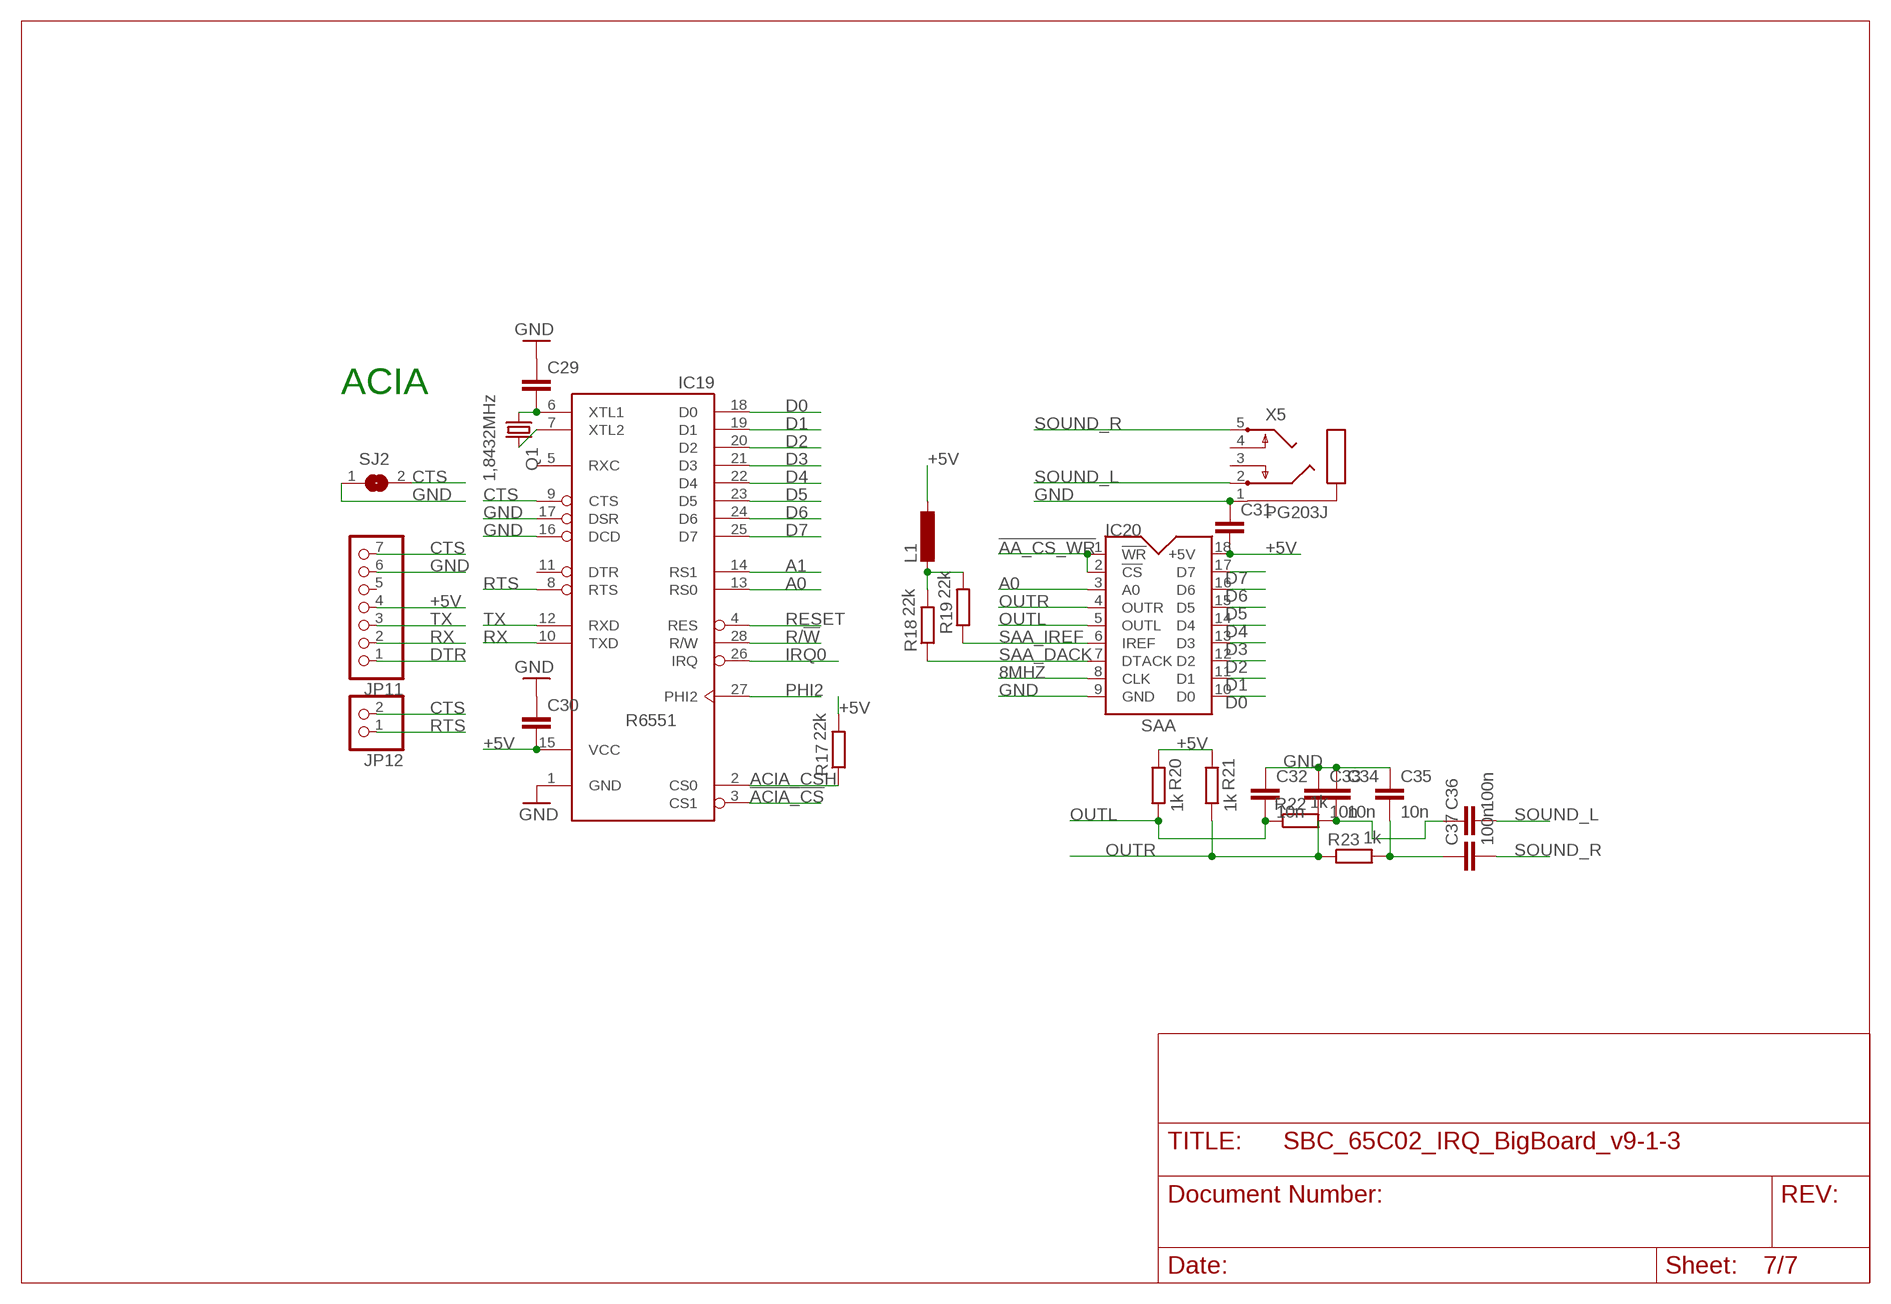
[diagram p6: schematic, sheet 7]

### Parts
C29  C-EU050-025X075  [C050-025X075]
C30  C-EU050-025X075  [C050-025X075]
C31  C-EU050-025X075  [C050-025X075]
C32  10n  C-EU050-025X075  [C050-025X075]
C33  10n  C-EU050-025X075  [C050-025X075]
C34  10n  C-EU050-025X075  [C050-025X075]
C35  10n  C-EU050-025X075  [C050-025X075]
C36  100n  C-EU050-025X075  [C050-025X075]
C37  100n  C-EU050-025X075  [C050-025X075]
IC19  R6551  [DIP-28]
IC20  SAA  SAA1099DIL18  [DIL18]
JP11  PINHD-1X7  [1X07]
JP12  PINHD-1X2  [1X02]
L1  L-EU0207/10  [0207/10]
Q1  1,8432MHz  CRYSTALHC49S  [HC49/S]
R17  22k  R-EU_0207/10  [0207/10]
R18  22k  R-EU_0207/10  [0207/10]
R19  22k  R-EU_0207/10  [0207/10]
R20  1k  R-EU_0207/10  [0207/10]
R21  1k  R-EU_0207/10  [0207/10]
R22  1k  R-EU_0207/10  [0207/10]
R23  1k  R-EU_0207/10  [0207/10]
SJ2  SJ  [SJ]
X5  PG203J  [PG203J]

### Nets
8MHZ: IC20.8(CLK) ; also sheet 2
!AA_CS_WR: IC20.1(!WR) IC20.2(!CS) ; also sheet 4
!ACIA_CS: IC19.3(CS1) ; also sheet 4
+5V [power]: C30.2 C31.2 IC19.15(VCC) IC20.18(+5V) JP11.4 L1.1 R17.2 R20.1 R21.1 ; also sheet 1,2,3,4,5,6
A0: IC19.13(RS0) IC20.3(A0) ; also sheet 3,6
A1: IC19.14(RS1) ; also sheet 3,6
ACIA_CSH: IC19.2(CS0) R17.1
CTS: IC19.9(CTS) JP11.7 JP12.2 SJ2.2
D0: IC19.18(D0) IC20.10(D0) ; also sheet 3,6
D1: IC19.19(D1) IC20.11(D1) ; also sheet 3,6
D2: IC19.20(D2) IC20.12(D2) ; also sheet 3,6
D3: IC19.21(D3) IC20.13(D3) ; also sheet 3,6
D4: IC19.22(D4) IC20.14(D4) ; also sheet 3,6
D5: IC19.23(D5) IC20.15(D5) ; also sheet 3,6
D6: IC19.24(D6) IC20.16(D6) ; also sheet 3,6
D7: IC19.25(D7) IC20.17(D7) ; also sheet 3,6
DTR: JP11.1 ; also sheet 3
GND: C29.1 C30.1 C31.1 C32.1 C33.1 C34.1 C35.1 IC19.1(GND) IC19.16(DCD) IC19.17(DSR) IC20.9(GND) JP11.6 SJ2.1 X5.1 ; also sheet 1,2,3,4,5,6
IRQ0: IC19.26(IRQ) ; also sheet 6
N$1: L1.2 R18.2 R19.2
N$15: C34.2 C36.1 R22.2
N$16: C35.2 C37.1 R23.2
N$34: C29.2 IC19.6(XTL1) Q1.1
N$35: IC19.7(XTL2) Q1.2
OUTL: C32.2 IC20.5(OUTL) R20.2 R22.1
OUTR: C33.2 IC20.4(OUTR) R21.2 R23.1
PHI2: IC19.27(PHI2) ; also sheet 3,4,6
R/!W: IC19.28(R/W) ; also sheet 3,4,6
RESET: IC19.4(RES) ; also sheet 3,6
RTS: IC19.8(RTS) JP12.1
RX: IC19.10(TXD) JP11.2 ; also sheet 3
SAA_DACK: IC20.7(DTACK) R18.1
SAA_IREF: IC20.6(IREF) R19.1
SOUND_L: C36.2 X5.2
SOUND_R: C37.2 X5.5
TX: IC19.12(RXD) JP11.3 ; also sheet 3
Unconnected: IC19.5(RXC) IC19.11(DTR) JP11.5 X5.3 X5.4

### Notes on the sheet
- ACIA

## Library data of the parts
C1 C3 C4 = rcl:CPOL-EU: POLARIZED CAPACITOR, European symbol; SPICEPREFIX: C
C2 C5-C15 C17 C20-C38 = rcl:C-EU: CAPACITOR, European symbol; SPICEPREFIX: C
IC1 = burr-brown:REG1117: 800mA and 1A Low Dropout (LDO) Positive Regulator 1.8V, 2.5V, 2.85V, 3.3V, 5V, and Adj; MPN: REG1117; OC_FARNELL: 1097566; OC_NEWARK: 14P6981
IC2 IC3 = 74xx-eu:74*74: Dual D type positive edge triggered FLIP FLOP, preset and clear
IC4 = TiRoRiN_Libs:W65C02SP: Western Digital Version
IC5 = microchip:28*64A: CMOS EEPROM 64 K (8 K x 8), low voltage; MPN: AT28C64B-15PU; OC_FARNELL: 1631144; OC_NEWARK: 96K6557
IC6 IC7 = memory-hitachi:62256P: MEMORY; OC_FARNELL: unknown; OC_NEWARK: unknown
IC8 = TiRoRiN_Libs:DS1233
IC9 IC11 = 74xx-eu:74*139: Dual 2-line to 4-line DECODER/DEMULTIPLEXER
IC10 IC12 = 74xx-eu:74*00: Quad 2-input NAND gate
IC14 = atmel:ATTINY26: 8-bit AVR tiny Microcontroller Status aktiv aktiv ATtiny26 ATtiny26L General purpose working registers 32 SRAM 128 B Program flash memory 2 kB EEPROM 128 B 8-bit Timer/Counter 1 8-bit Timer/Counter (high speed) 1 USI 1 ADC channels 11 ADC resolution 10 bit AC 1 Watchdog 1 General purpose I/O 16 External interrupts 11 Operating voltage 4.0 ... 5.5 V 2.7 ... 5.5 V Speed grade 0 ... 16 MHz 0 ... 8 MHz Clock options calibrated internal 1/2/4/8 MHz RC oscillator external crystal oscillator / ceramic resonator external 32.768 kHz low-frequency crystal oscillator external RC oscillator high frequency PLL clock external clock input
IC16 IC18 = 6502:W65C22S: W65C22 by WDC
IC17 = 74xx-eu:74*148: 10-line to 4-line and 8-line to 3-line PRIORITY ENCODER
IC19 = 65xxx:R6551: Rockwell R6551 ACIA Asynchronous Communiations Interface Adapter, providing UART and on-chip baud rate generator using a standard 1.8432 MHz external crystal, for speeds from 50 to 19,200 baud.
IC20 = TiRoRiN_Libs:SAA1099
IC21 = 74xx-eu:74*32: Quad 2-input OR gate
J1 = con-jack:DCJ0202: DC POWER JACK Source: DCJ0202.pdf; OC_FARNELL: unknown; OC_NEWARK: unknown
J2 = SparkFun-Connectors:AVR_SPI_PROG_3X2: AVR ISP 6 Pin This is the reduced ISP connector for AVR programming. Common on Arduino. This footprint will take up less PCB space and can be used with a 10-pin to 6-pin adapter such as SKU: BOB-08508 **Special note about "TEST_POINT" package. The stop mask is on the top side, so if you want your programming test points to be on the bottom of your board, make sure to place this package on the bottom side of the board. This also ensure that the orientation to program from the bottom side will be correct. SparkFun Products: SparkFun ISP Pogo Adapter <https://www.sparkfun.com/products/11591> - NS Tiny AVR Programmer <https://www.sparkfun.com/products/11801> -PTH
J3 = SparkFun-Connectors:DB9: DB9 Connector Standard DB9 (D-Sub 9) serial connector. Can be used for CAN bus as well as RS485 and RS232. Footprint production proven. Here is the female version connector we sell at SparkFun: 9 Pin Female Serial Connector - PCB Mount <https://www.sparkfun.com/products/429> (PRT-00429) This connector has been used on the following SparkFun products: SparkFun RS232 Shifter - SMD <https://www.sparkfun.com/products/449> (PRT-00449) SparkFun RS232 Shifter SMD (No DB9) <https://www.sparkfun.com/products/8780> (PRT-08780); PROD_ID: CONN-09904
JP1 JP12 = pinhead:PINHD-1X2: PIN HEADER
JP2-JP5 JP13 = pinhead:PINHD-1X1: PIN HEADER
JP6 = pinhead:PINHD-1X11: PIN HEADER
JP8 JP10 = pinhead:PINHD-2X10: PIN HEADER
JP9 = pinhead:PINHD-2X2: PIN HEADER
JP11 = pinhead:PINHD-1X7: PIN HEADER
L1 = rcl:L-EU: INDUCTOR, European symbol; SPICEPREFIX: L
LED1-LED7 = led:LED: LED OSRAM: - CHIPLED LG R971, LG N971, LY N971, LG Q971, LY Q971, LO R971, LY R971 LH N974, LH R974 LS Q976, LO Q976, LY Q976 LO Q996 - Hyper CHIPLED LW Q18S LB Q993, LB Q99A, LB R99A - SideLED LS A670, LO A670, LY A670, LG A670, LP A670 LB A673, LV A673, LT A673, LW A673 LH A674 LY A675 LS A676, LA A676, LO A676, LY A676, LW A676 LS A679, LY A679, LG A679 - Hyper Micro SIDELED® LS Y876, LA Y876, LO Y876, LY Y876 LT Y87S - SmartLED LW L88C, LW L88S LB L89C, LB L89S, LG L890 LS L89K, LO L89K, LY L89K LS L896, LA L896, LO L896, LY L896 - TOPLED LS T670, LO T670, LY T670, LG T670, LP T670 LSG T670, LSP T670, LSY T670, LOP T670, LYG T670 LG T671, LOG T671, LSG T671 LB T673, LV T673, LT T673, LW T673 LH T674 LS T676, LA T676, LO T676, LY T676, LB T676, LH T676, LSB T676, LW T676 LB T67C, LV T67C, LT T67C, LS T67K, LO T67K, LY T67K, LW E67C LS E67B, LA E67B, LO E67B, LY E67B, LB E67C, LV E67C, LT E67C LW T67C LS T679, LY T679, LG T679 LS T770, LO T770, LY T770, LG T770, LP T770 LB T773, LV T773, LT T773, LW T773 LH T774 LS E675, LA E675, LY E675, LS T675 LS T776, LA T776, LO T776, LY T776, LB T776 LHGB T686 LT T68C, LB T68C - Hyper Mini TOPLED® LB M676 - Mini TOPLED Santana® LG M470 LS M47K, LO M47K, LY M47K Source: http://www.osram.convergy.de LUXEON: - LUMILED® LXK2-PW12-R00, LXK2-PW12-S00, LXK2-PW14-U00, LXK2-PW14-V00 LXK2-PM12-R00, LXK2-PM12-S00, LXK2-PM14-U00 LXK2-PE12-Q00, LXK2-PE12-R00, LXK2-PE12-S00, LXK2-PE14-T00, LXK2-PE14-U00 LXK2-PB12-K00, LXK2-PB12-L00, LXK2-PB12-M00, LXK2-PB14-N00, LXK2-PB14-P00, LXK2-PB14-Q00 LXK2-PR12-L00, LXK2-PR12-M00, LXK2-PR14-Q00, LXK2-PR14-R00 LXK2-PD12-Q00, LXK2-PD12-R00, LXK2-PD12-S00 LXK2-PH12-R00, LXK2-PH12-S00 LXK2-PL12-P00, LXK2-PL12-Q00, LXK2-PL12-R00 Source: www.luxeon.com KINGBRIGHT: KA-3528ASYC Source: www.kingbright.com
Q1 = crystal:CRYSTAL: CRYSTAL; OC_FARNELL: 1667008; OC_NEWARK: unknown
QG1 = crystal:QG5860: CRYSTAL RESONATOR; OC_FARNELL: unknown; OC_NEWARK: unknown
R1 R2 R10-R13 = resistor:R-EU_: RESISTOR, European symbol
R3-R6 R14-R23 = rcl:R-EU_: RESISTOR, European symbol; SPICEPREFIX: R
R7-R9 = rcl:R-EU_: RESISTOR, European symbol
RN1 RN2 = resistor-sil:G08R: SIL RESISTOR; OC_FARNELL: unknown; OC_NEWARK: unknown
S1-S3 = switch-omron:10-XX: OMRON SWITCH; MPN: B3F-1000; OC_FARNELL: 176432; OC_NEWARK: 36M3542
SJ1 SJ2 = jumper:SJ: SMD solder JUMPER
X1-X3 = TiRoRiN_Libs:ISA-SLOT: ISA SLOT
X4 = mini_din:MINI_DIN_6
X5 = con-hirschmann:PG203J: MIC/HEADPHONE JACK KS-S stereo microphone/headphone jack PG203JN (Schukat); OC_FARNELL: unknown; OC_NEWARK: unknown

## Net classes
0 default: width 0.254 mm, drill 0.66 mm, clearance 0.203 mm
1 power: width 0.508 mm, drill 0.66 mm, clearance 0.254 mm to class 0, clearance 0.254 mm